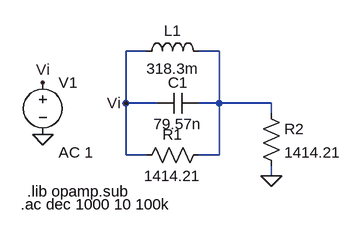
[diagram p0: schematic eb_pasivo.asc]
eb_pasivo.asc, the LTspice schematic file:
Version 4
SHEET 1 880 680
WIRE 48 80 16 80
WIRE 160 80 128 80
WIRE 16 160 16 80
WIRE 64 160 16 160
WIRE 160 160 160 80
WIRE 160 160 128 160
WIRE 240 160 160 160
WIRE 240 176 240 160
WIRE 16 240 16 160
WIRE 48 240 16 240
WIRE 160 240 160 160
WIRE 160 240 128 240
WIRE 240 272 240 256
FLAG 240 272 0
FLAG 16 160 Vi
FLAG -112 128 Vi
FLAG -112 208 0
SYMBOL ind 32 96 R270
WINDOW 0 32 56 VTop 2
WINDOW 3 5 56 VBottom 2
SYMATTR InstName L1
SYMATTR Value 318.3m
SYMBOL cap 128 144 R90
WINDOW 0 0 32 VBottom 2
WINDOW 3 32 32 VTop 2
SYMATTR InstName C1
SYMATTR Value 79.57n
SYMBOL res 144 224 R90
WINDOW 0 0 56 VBottom 2
WINDOW 3 32 56 VTop 2
SYMATTR InstName R1
SYMATTR Value 1414.21
SYMBOL res 224 160 R0
SYMATTR InstName R2
SYMATTR Value 1414.21
SYMBOL voltage -112 112 R0
WINDOW 123 24 124 Left 2
WINDOW 39 0 0 Left 0
SYMATTR InstName V1
SYMATTR Value ""
SYMATTR Value2 AC 1
TEXT -136 296 Left 2 !.lib opamp.sub
TEXT -146 316 Left 2 !.ac dec 1000 10 100k

The netlist it stands for:
* eb_pasivo.asc
L1 Vi N001 318.3m
C1 N001 Vi 79.57n
R1 N001 Vi 1414.21
R2 N001 0 1414.21
V1 Vi 0 AC 1
.lib opamp.sub
.ac dec 1000 10 100k
.backanno
.end